# EAGLE design Grove - Digital Infrared Temperature Sensor v1.0 (EAGLE 6.4)

## Sheet 1 of 2
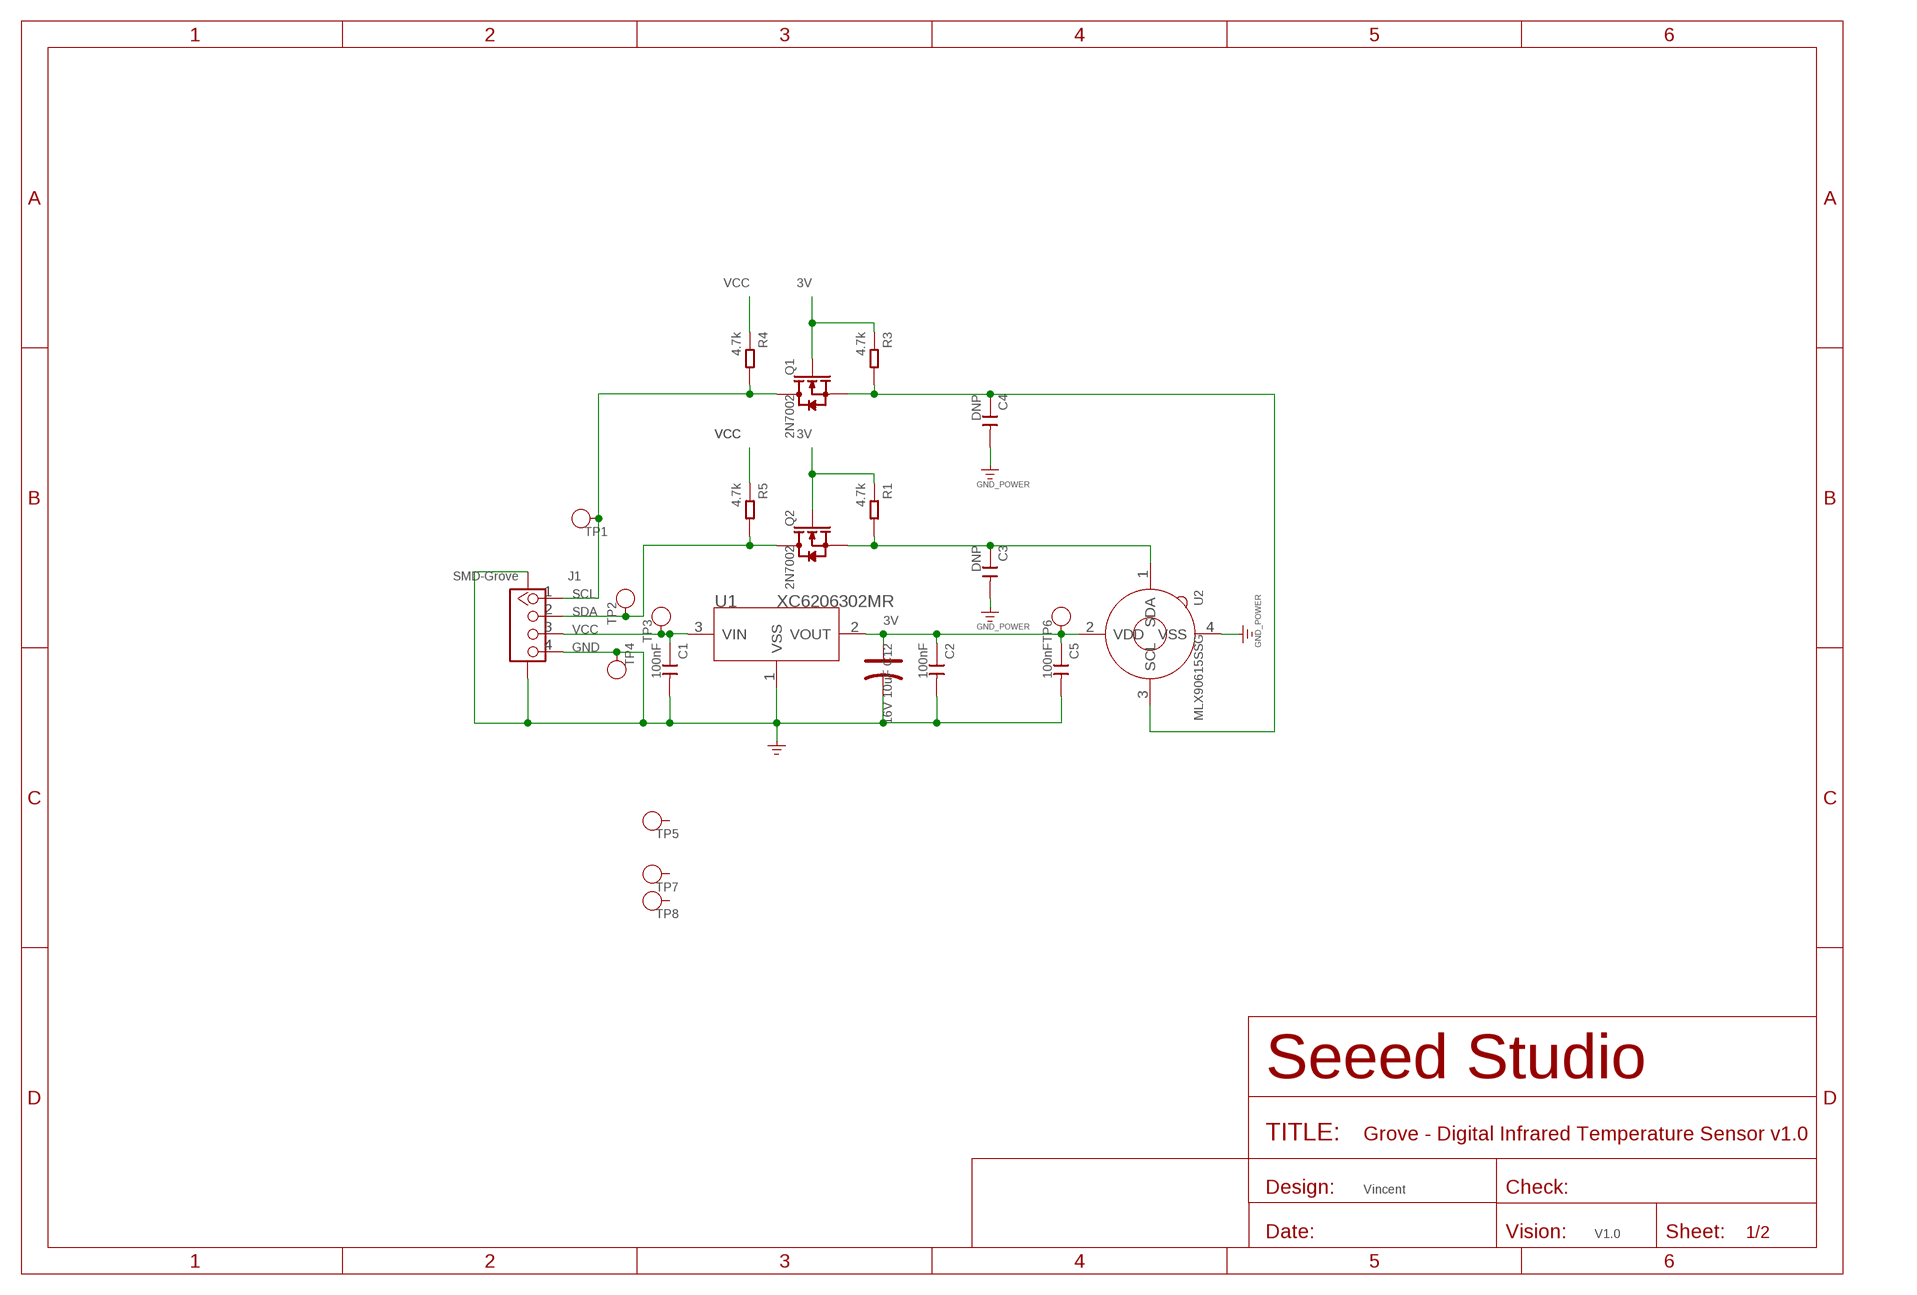
[diagram p0: schematic, sheet 1]

### Parts
C1  100nF  CAP-0603  [C0603]
C2  100nF  CAP-0603  [C0603]
C3  DNP  CAP-0603  [C0603]
C4  DNP  CAP-0603  [C0603]
C5  100nF  CAP-0603  [C0603]
C12  16V 10uF  CAP-AVX-A  [AVX-A]
J1  SMD-Grove  GROVE-CONNECTOR-SMD'DD'  [4P-SMD-2.0]
Q1  2N7002  MOSFET-N'SOT23'  [SOT23]
Q2  2N7002  MOSFET-N'SOT23'  [SOT23]
R1  4.7k  RES-0603  [R0603]
R3  4.7k  RES-0603  [R0603]
R4  4.7k  RES-0603  [R0603]
R5  4.7k  RES-0603  [R0603]
TP1  PAD-TEST-POINT'4545'  [TP-D45MIL]
TP2  PAD-TEST-POINT'4545'  [TP-D45MIL]
TP3  PAD-TEST-POINT'4545'  [TP-D45MIL]
TP4  PAD-TEST-POINT'4545'  [TP-D45MIL]
TP5  PAD-TEST-POINT'4545'  [TP-D45MIL]
TP6  PAD-TEST-POINT'4545'  [TP-D45MIL]
TP7  PAD-TEST-POINT'4545'  [TP-D45MIL]
TP8  PAD-TEST-POINT'4545'  [TP-D45MIL]
U1  XC6206302MR  XC6206MR  [SOT23]
U2  MLX90615SSG  SENSOR-MLX90615  [4P-D5.4MM*2.7H]

### Nets
3V: C2.1 C5.1 C12.+ Q1.1(G) Q2.1(G) R1.1 R3.1 TP6.T U1.2(VOUT) U2.2(VDD)
GND: C1.2 C2.2 C3.2 C4.2 C5.2 C12.- J1.4 J1.SS1 J1.SS2 TP4.T U1.1(VSS) U2.4(VSS) ; supply symbol labelled GND_POWER
N$3: C4.1 Q1.2(S) R3.2 U2.3(SCL)
N$4: C3.1 Q2.2(S) R1.2 U2.1(SDA)
SCL: J1.1 Q1.3(D) R4.2 TP1.T
SDA: J1.2 Q2.3(D) R5.2 TP2.T
VCC: C1.1 J1.3 R4.1 R5.1 TP3.T U1.3(VIN)
Unconnected: TP5.T TP7.T TP8.T

### Notes on the sheet
- Vincent
- V1.0

## Sheet 2 of 2
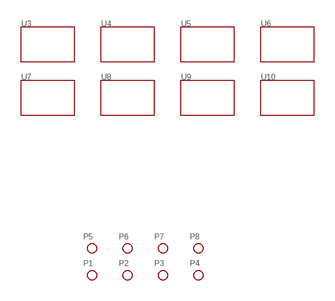
[diagram p1: schematic, sheet 2]

### Parts
P1  PAD-MARK  [ROUND-MARK-1.0]
P2  PAD-MARK  [ROUND-MARK-1.0]
P3  PAD-MARK  [ROUND-MARK-1.0]
P4  PAD-MARK  [ROUND-MARK-1.0]
P5  PAD-MARK  [ROUND-MARK-1.0]
P6  PAD-MARK  [ROUND-MARK-1.0]
P7  PAD-MARK  [ROUND-MARK-1.0]
P8  PAD-MARK  [ROUND-MARK-1.0]
U3  TWIG'2U'  [GROVE-TEST-PLATFORM]
U4  TWIG'2U'  [GROVE-TEST-PLATFORM]
U5  TWIG'2U'  [GROVE-TEST-PLATFORM]
U6  TWIG'2U'  [GROVE-TEST-PLATFORM]
U7  TWIG'2U'  [GROVE-TEST-PLATFORM]
U8  TWIG'2U'  [GROVE-TEST-PLATFORM]
U9  TWIG'2U'  [GROVE-TEST-PLATFORM]
U10  TWIG'2U'  [GROVE-TEST-PLATFORM]

## Library data of the parts
C1-C5 = Discrete-new:CAP: Ceramic Capacitors
C12 = Discrete:CAP*: Electrolytic Capacitors,Tantalum Capacitors and Super Capacitors
J1 = Connector-new:GROVE-CONNECTOR-SMD: 4P-SMD-2.0:320110030;4P-SMD-2.0-90D:320110032
P1-P8 = Discrete:PAD-MARK; PARTNO: DNP
Q1 Q2 = Discrete:MOSFET-N: IRLL014: http://www.vishay.com/docs/91319/sihll014.pdf
R1 R3-R5 = Discrete-new:RES
TP1-TP8 = Discrete-new:PAD-TEST-POINT; PARTNO: DNP
U1 = IC:XC6206: LOW ESR Cap.Compatible Positive Voltage Regulators
U2 = template :SENSOR-MLX90615: Infra Red Thermometer
U3-U10 = template:TWIG

## Board
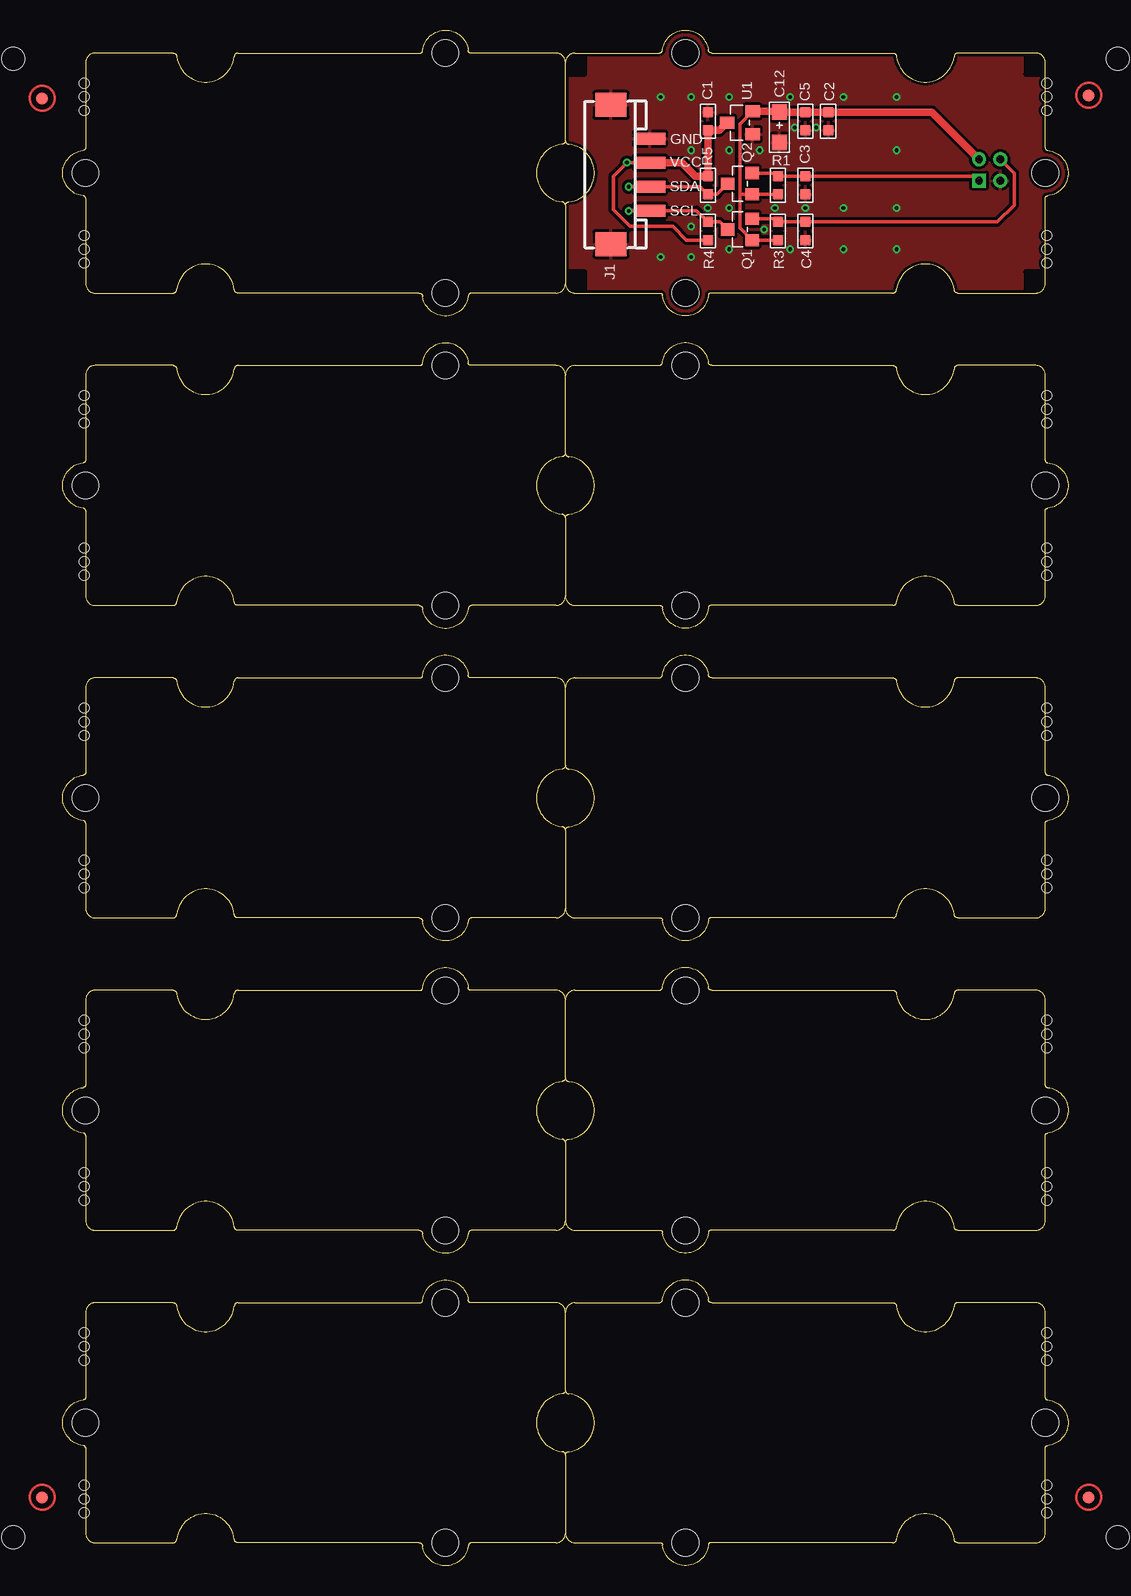
[diagram p2: board, top side]
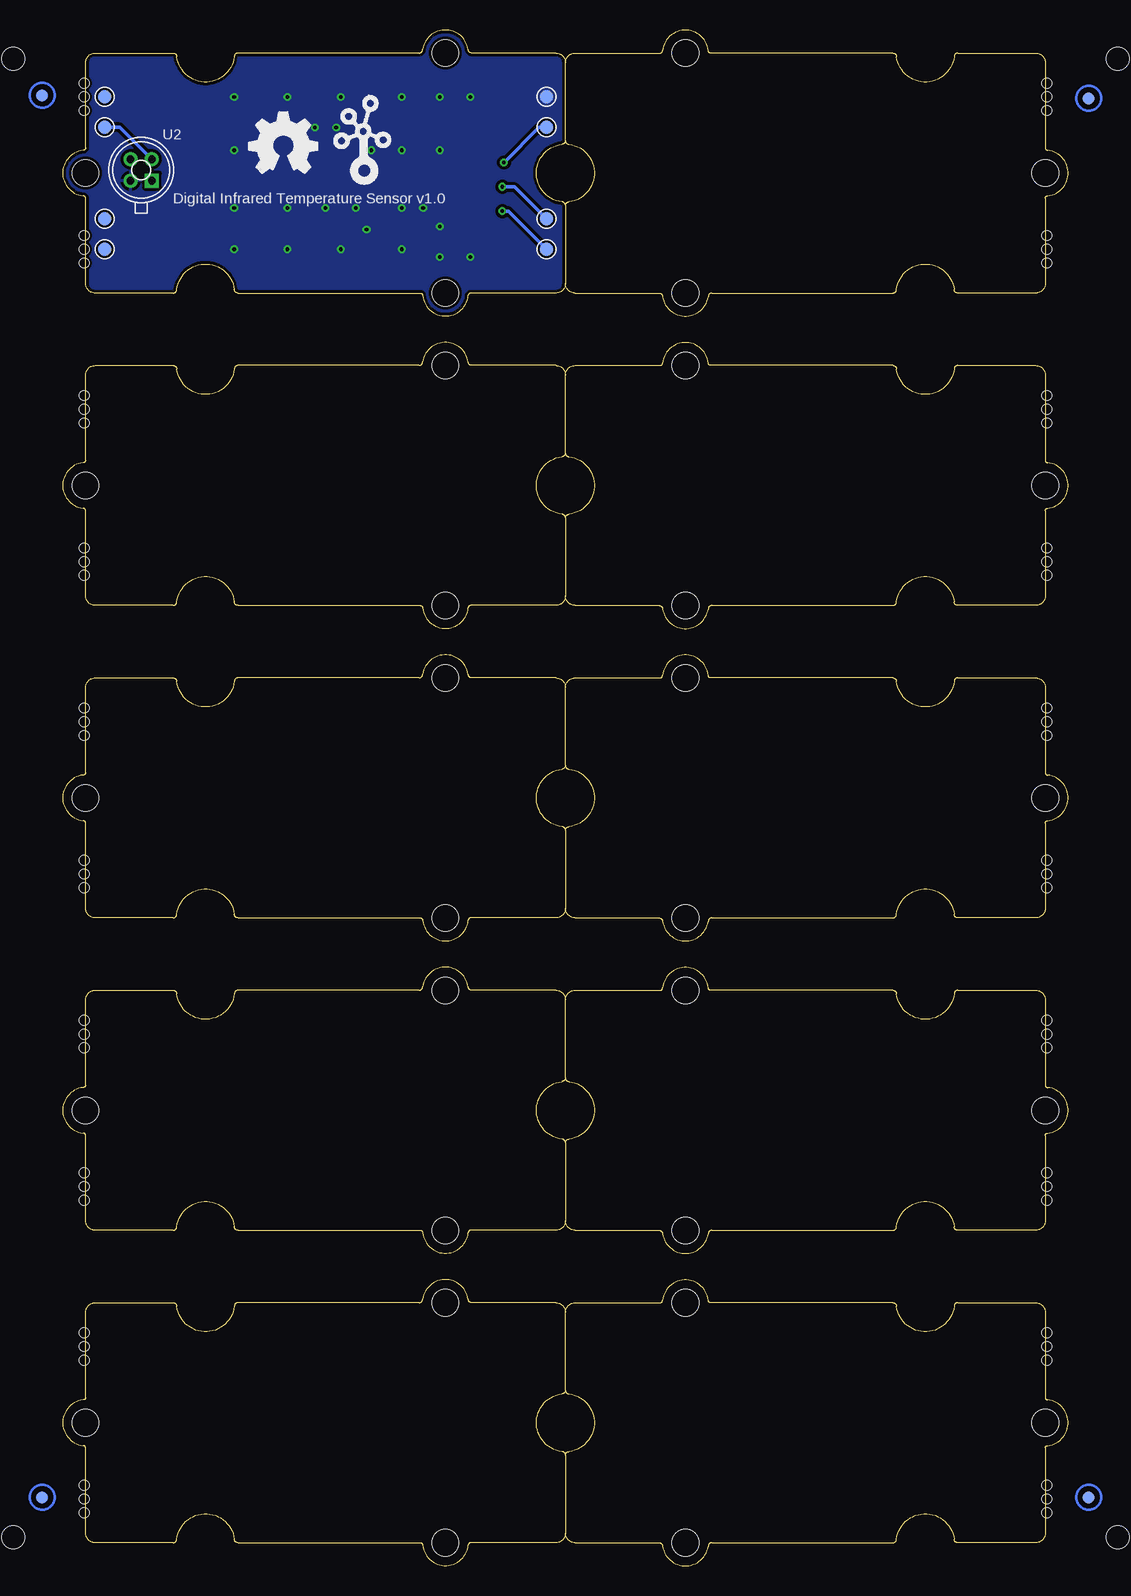
[diagram p3: board, bottom side, seen from below]

Size 83.82 x 127.98 mm. Coordinates in mm from the lower left corner, seen from the top.
Copper layers (1*16): Top 0.035mm / dielectric 1.5mm / Bottom 0.035mm
Design rules "SeeedStudio_2layer_DRU_no_angle_20140221 *": minimum track width 6mil, minimum drill 12mil, track to track 6mil, track to pad 6mil, pad to pad 6mil, via to via 6mil, smd to smd 0mil, copper to edge 10mil, drill to drill 10mil, minimum pad ring 10mil, minimum via ring 6mil, stop-mask expansion 2mil, vias tented up to drill 100mil, thermal gap 10mil
Holes 0.8 mm at 1.78,123.55 1.78,121.27 1.78,122.41 1.78,110.85 1.78,108.57 1.78,109.71 1.78,97.52 1.78,95.23 1.78,96.38 1.78,84.82 1.78,82.53 1.78,83.68 1.78,71.48 1.78,69.2 1.78,70.34 1.78,58.78 1.78,56.5 1.78,57.64 1.78,45.45 1.78,43.16 1.78,44.31 1.78,32.75 1.78,30.46 1.78,31.61 1.78,19.41 1.78,17.13 1.78,18.27 1.78,6.71 1.78,4.43 1.78,5.57 82.04,121.27 82.04,123.55 82.04,122.41 82.04,108.57 82.04,110.85 82.04,109.71 82.04,95.23 82.04,97.52 82.04,96.38 82.04,82.53 82.04,84.82 82.04,83.68 82.04,69.2 82.04,71.48 82.04,70.34 82.04,56.5 82.04,58.78 82.04,57.64 82.04,43.16 82.04,45.45 82.04,44.31 82.04,30.46 82.04,32.75 82.04,31.61 82.04,17.13 82.04,19.41 82.04,18.27 82.04,4.43 82.04,6.71 82.04,5.57
Holes 1.91 mm at -4.13,2.4 87.95,2.4 87.95,125.59 -4.13,125.59

### Footprints (pad centres in the part's own frame; a part is rotated, then mirrored left to right if it is on the bottom)
C0603 = smd 0.889 x 0.889: 1 -0.762,0; 2 0.762,0
AVX-A = smd 1.27 x 1.27: + -1.27,0; - 1.27,0
4P-SMD-2.0 = smd 1 x 2.54: 1 -3,0; 2 -1,0; 3 1,0; 4 3,0 | smd 2 x 2.6: SS1 -5.8,3.25; SS2 5.8,3.25
ROUND-MARK-1.0 = smd 1.016 x 1.016: P$1 0,0
SOT23 = smd 1.016 x 1.143: 1 -0.889,-1.016; 2 0.889,-1.016; 3 0,1.016
R0603 = smd 0.889 x 0.889: 1 -0.762,0; 2 0.762,0
TP-D45MIL = smd 1.143 x 1.143: T 0,0
SOT23' = smd 1.016 x 1.2: 1 -0.95,-1.06; 2 0.95,-1.06; 3 0,1.06
4P-D5.4MM*2.7H = drill 0.65 pad 1.15 square: 1 0.889,-0.889 | drill 0.65 pad 1.15: 2 0.889,0.889; 3 -0.889,0.889; 4 -0.889,-0.889
GROVE-TEST-PLATFORM = hole 2.2: -10,-10; -10,10; 20,0
GROVE-TEST-PLATFORM@1 = hole 2.2: -10,-10; -10,10; 20,0
GROVE-1*2-TEST-PLATFORM = hole 2.2: -10,-10; -10,10; 20,0

### Placement (x,y rotation side)
C1  53.79,120.38 90 top
C2  63.82,120.38 270 top
C3  61.91,115.05 270 top
C4  61.91,111.24 270 top
C5  61.91,120.38 270 top
C12  59.75,119.87 270 top
J1  48.96,115.93 90 top
P1  -1.71,5.7 0 top
P2  85.54,5.7 0 top
P3  -1.71,122.28 0 top
P4  85.54,122.54 0 top
P5  -1.71,5.7 0 bottom
P6  85.54,5.7 0 bottom
P7  85.54,122.54 0 bottom
P8  -1.71,122.28 0 bottom
Q1  56.45,111.36 90 top
Q2  56.45,115.17 90 top
R1  59.63,115.05 90 top
R3  59.63,111.24 90 top
R4  53.79,111.24 90 top
R5  53.79,115.05 270 top
TP1  43.5,109.71 0 bottom
TP2  43.5,112.25 0 bottom
TP3  43.5,119.87 0 bottom
TP4  43.5,122.41 0 bottom
TP5  80.33,122.41 0 bottom
TP6  80.33,119.87 0 bottom
TP7  80.33,112.25 0 bottom
TP8  80.33,109.71 0 bottom
U1  XC6206302MR  [SOT23']  56.45,120.25 90 top
U2  77.28,116.32 0 bottom
U3  61.91,37.96 0 top
U4  21.91,37.96 180 top
U5  61.91,63.99 0 top
U6  21.91,63.99 180 top
U7  61.91,90.03 0 top
U8  21.91,90.03 180 top
U9  21.91,116.06 180 top
U10  61.91,116.06 0 top
U11  [GROVE-TEST-PLATFORM@1]  61.91,11.92 0 top
U12  [GROVE-TEST-PLATFORM@1]  21.91,11.92 180 top
U$2  [GROVE-SILK-BIG]  58.74,116.06 0 bottom
U$4  [GROVE-1*2-TEST-PLATFORM]  61.91,116.06 0 top
U$5  [OSHW_FILLX200_NOTEXT]  68.27,116.06 0 bottom

### Tracks (layer width: path | path; a pad name or v marks a point on that pad's centre or on a via)
3V
  Top 0.305: R3.1 Q1.1 56.45,111.49 56.45,114.16 | R1.1 Q2.1 56.71,114.28 56.58,114.28 | 56.58,114.28 56.45,114.16 | 56.45,114.16 56.45,114.41 | 56.45,114.41 56.45,120.14 U1.2 | 56.58,114.28 56.45,114.41
  Top 0.61: U1.2 59.69,121.2 C12.+ C5.1 C2.1 72.45,121.14 U2.2
  Bottom 0.305: U2.2 79.06,119.87 TP6.T
GND  (via drill 0.3 pad 0.64)
  other vias: 58.1,117.97 52.39,111.62 53.79,113.14 52.39,117.97 58.48,111.36 61.91,113.14 61.02,119.87 65.09,113.14 69.53,113.14 52.39,109.08 49.85,122.41 52.39,122.41 55.56,113.14 59.37,113.14 55.56,117.97 65.09,122.41 62.8,119.87 49.85,109.08 55.56,109.71 60.64,109.71 65.09,109.71 69.53,109.71 69.53,117.97 69.53,122.41 60.64,122.41 55.56,122.41
  pour Top (isolate 0.254): 40.58,128.51 85.03,128.51 85.03,103.11 40.58,103.11
  pour Bottom (isolate 0.254): 40.58,128.51 85.03,128.51 85.03,103.11 40.58,103.11
N$3
  Top 0.305: Q1.2 59.37,112.25 R3.2 C4.1 77.92,112 79.31,113.39 79.31,116.06 U2.3
N$4
  Top 0.305: Q2.2 59.37,116.06 R1.2 C3.1 76.01,115.81 U2.1
SCL  (via drill 0.3 pad 0.64)
  Top 0.203: 47.18,112.93 v47.18,112.89
  Top 0.305: 47.18,112.93 J1.1 52.85,112.93 R4.2 54.8,112 Q1.3
  Bottom 0.305: v47.18,112.89 46.67,112.89 TP1.T
SDA  (via drill 0.3 pad 0.64)
  Top 0.203: 47.2,114.93 v47.18,114.92
  Top 0.305: 47.2,114.93 J1.2 53.13,114.93 R5.2 54.55,114.28 Q2.3
  Bottom 0.305: v47.18,114.92 46.17,114.92 TP2.T
VCC  (via drill 0.3 pad 0.64)
  Top 0.305: J1.3 v47.04,116.93 45.91,115.81 45.91,113.01 47.31,111.62 50.86,111.62 52.01,110.47 R4.1
  Top 0.61: 55.27,120.38 U1.3
  Top 0.635: J1.3 51.64,116.93 52.77,115.81 R5.1 C1.1 54.76,119.62 U1.3
  Bottom 0.305: v47.04,116.93 44.1,119.87 TP3.T

### Text on the board
tPlace: GND | VCC | SDA | SCL
bPlace: Digital Infrared Temperature Sensor v1.0